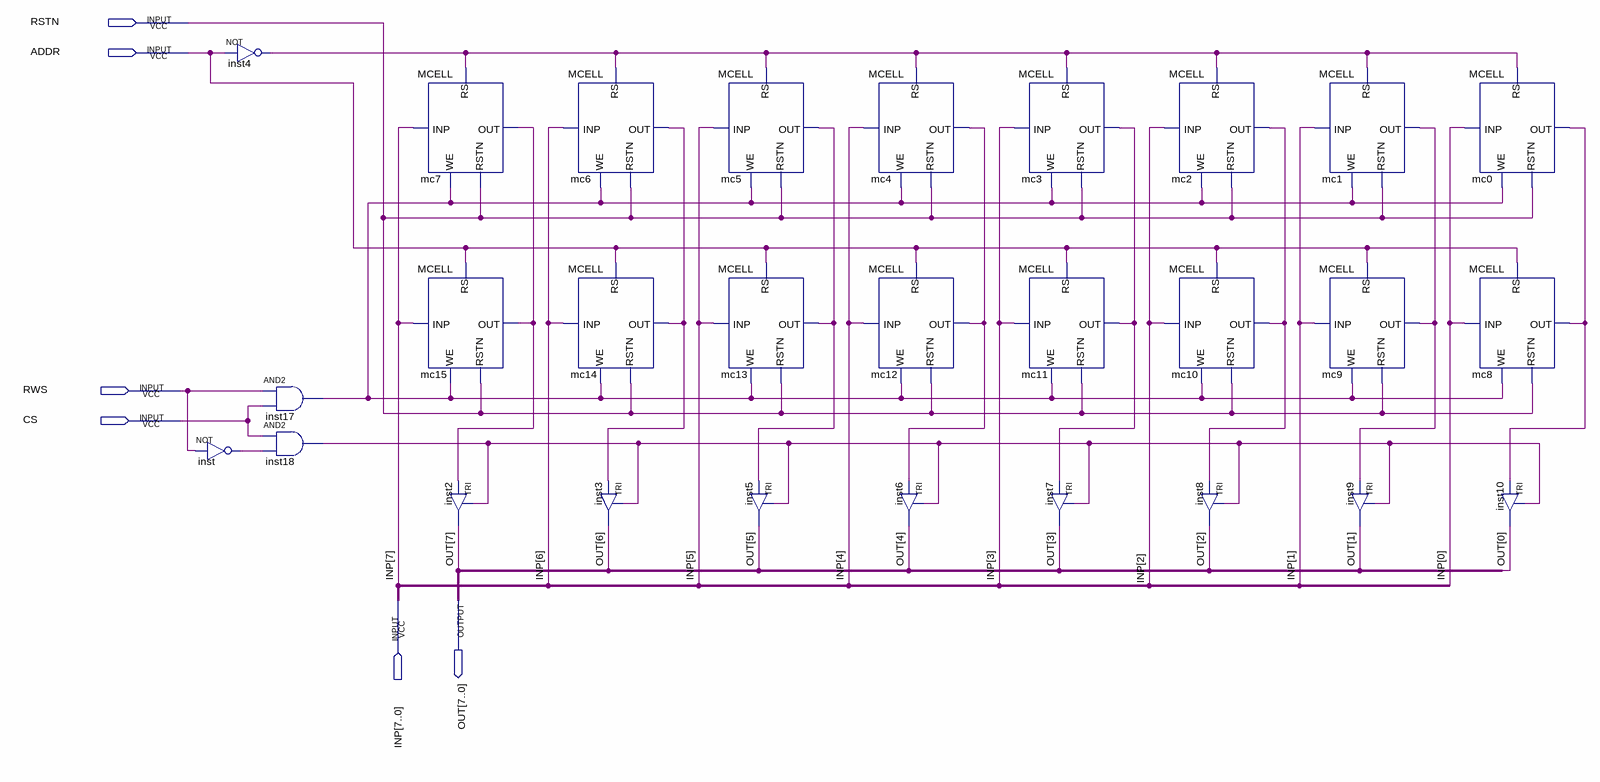
[diagram p0: schematic sheet]
// Quartus schematic 2X8RAM.bdf as structural Verilog: 28 symbols, 6 pins
module \2X8RAM  (
  input  RSTN,
  input  ADDR,
  input  RWS,
  input  CS,
  input  [7:0] INP,
  output [7:0] OUT
);

  wire inst4_out, inst17_out, inst18_out, inst_out, mc0_out, mc1_out, mc2_out, mc3_out, mc4_out, mc5_out,
       mc6_out, mc7_out;

  not inst (inst_out, RWS);
  not inst4 (inst4_out, ADDR);
  and inst17 (inst17_out, RWS, CS);
  and inst18 (inst18_out, CS, inst_out);
  MCELL mc7 (.RS(inst4_out), .INP(INP[7]), .RSTN(RSTN), .WE(inst17_out), .OUT(mc7_out));
  MCELL mc15 (.RS(ADDR), .INP(INP[7]), .RSTN(RSTN), .WE(inst17_out), .OUT(mc7_out));
  TRI inst2 (.IN(mc7_out), .OE(inst18_out), .OUT(OUT[7]));
  MCELL mc6 (.RS(inst4_out), .INP(INP[6]), .RSTN(RSTN), .WE(inst17_out), .OUT(mc6_out));
  MCELL mc14 (.RS(ADDR), .INP(INP[6]), .RSTN(RSTN), .WE(inst17_out), .OUT(mc6_out));
  TRI inst3 (.IN(mc6_out), .OE(inst18_out), .OUT(OUT[6]));
  MCELL mc5 (.RS(inst4_out), .INP(INP[5]), .RSTN(RSTN), .WE(inst17_out), .OUT(mc5_out));
  MCELL mc13 (.RS(ADDR), .INP(INP[5]), .RSTN(RSTN), .WE(inst17_out), .OUT(mc5_out));
  TRI inst5 (.IN(mc5_out), .OE(inst18_out), .OUT(OUT[5]));
  MCELL mc4 (.RS(inst4_out), .INP(INP[4]), .RSTN(RSTN), .WE(inst17_out), .OUT(mc4_out));
  MCELL mc12 (.RS(ADDR), .INP(INP[4]), .RSTN(RSTN), .WE(inst17_out), .OUT(mc4_out));
  TRI inst6 (.IN(mc4_out), .OE(inst18_out), .OUT(OUT[4]));
  MCELL mc3 (.RS(inst4_out), .INP(INP[3]), .RSTN(RSTN), .WE(inst17_out), .OUT(mc3_out));
  MCELL mc11 (.RS(ADDR), .INP(INP[3]), .RSTN(RSTN), .WE(inst17_out), .OUT(mc3_out));
  TRI inst7 (.IN(mc3_out), .OE(inst18_out), .OUT(OUT[3]));
  MCELL mc2 (.RS(inst4_out), .INP(INP[2]), .RSTN(RSTN), .WE(inst17_out), .OUT(mc2_out));
  MCELL mc10 (.RS(ADDR), .INP(INP[2]), .RSTN(RSTN), .WE(inst17_out), .OUT(mc2_out));
  TRI inst8 (.IN(mc2_out), .OE(inst18_out), .OUT(OUT[2]));
  MCELL mc1 (.RS(inst4_out), .INP(INP[1]), .RSTN(RSTN), .WE(inst17_out), .OUT(mc1_out));
  MCELL mc9 (.RS(ADDR), .INP(INP[1]), .RSTN(RSTN), .WE(inst17_out), .OUT(mc1_out));
  TRI inst9 (.IN(mc1_out), .OE(inst18_out), .OUT(OUT[1]));
  MCELL mc0 (.RS(inst4_out), .INP(INP[0]), .RSTN(RSTN), .WE(inst17_out), .OUT(mc0_out));
  MCELL mc8 (.RS(ADDR), .INP(INP[0]), .RSTN(RSTN), .WE(inst17_out), .OUT(mc0_out));
  TRI inst10 (.IN(mc0_out), .OE(inst18_out), .OUT(OUT[0]));
endmodule
